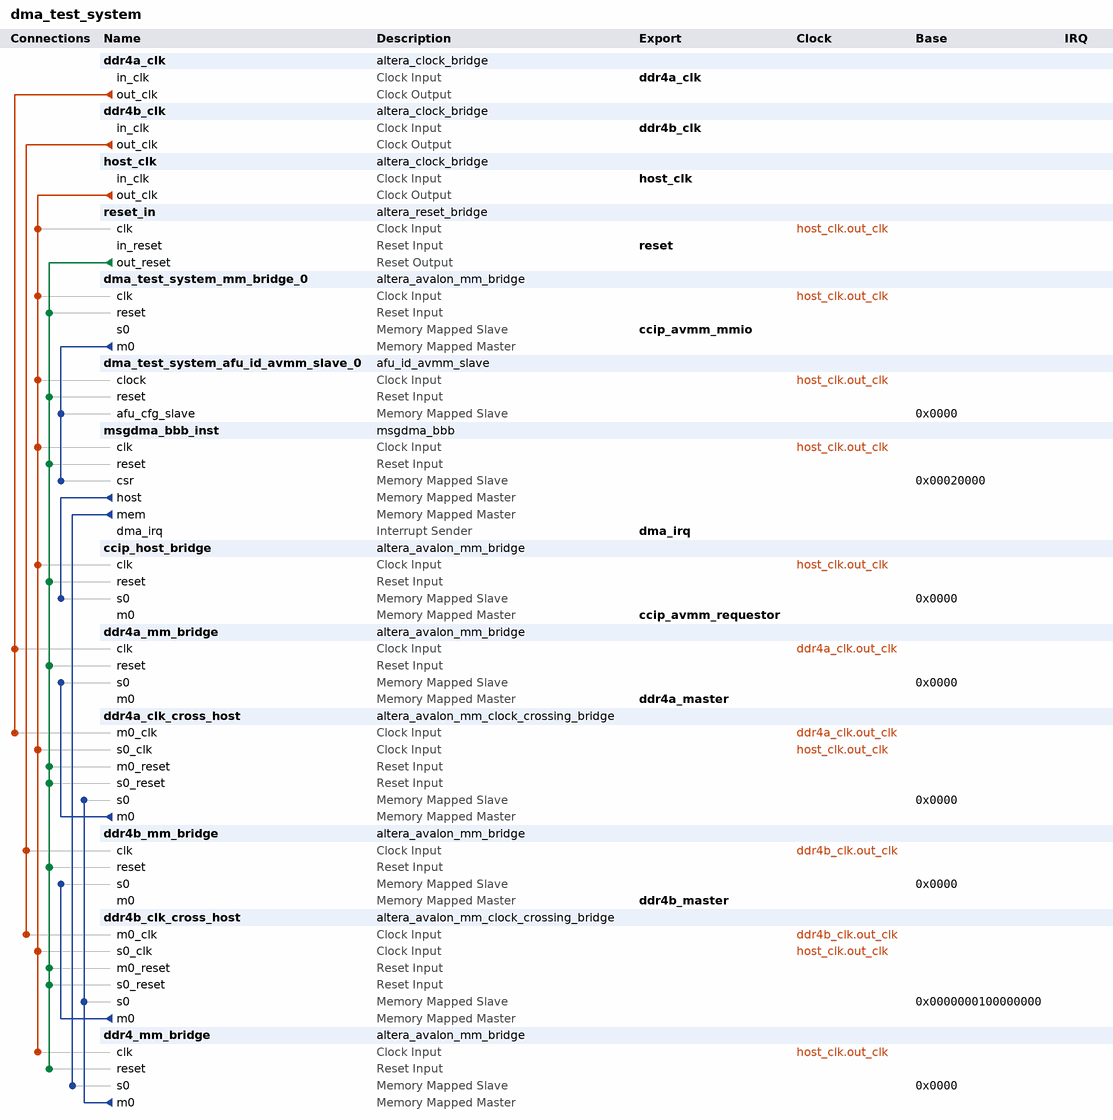
[diagram p0: system contents]
# Platform Designer (Qsys) system dma_test_system, Arria 10 10AX115N3F40E2SG
# Parameters at their usual value, and those the tool derives, are not listed.
package require -exact qsys 1.0
create_system dma_test_system
set_project_property DEVICE_FAMILY {Arria 10}
set_project_property DEVICE 10AX115N3F40E2SG

add_component ddr4a_clk ip/dma_test_system/dma_test_system_clock_bridge_1.ip altera_clock_bridge ddr4a_clk 17.0

add_component ddr4b_clk ip/dma_test_system/dma_test_system_clock_bridge_0.ip altera_clock_bridge ddr4b_clk 17.0
load_component ddr4b_clk
set_component_parameter_value DERIVED_CLOCK_RATE 0
set_component_parameter_value EXPLICIT_CLOCK_RATE 400
save_component

add_component host_clk ip/dma_test_system/dma_test_system_clock_bridge_2.ip altera_clock_bridge host_clk 17.0

add_component reset_in ip/dma_test_system/dma_test_system_reset_in.ip altera_reset_bridge reset_in 17.0
load_component reset_in
set_component_parameter_value ACTIVE_LOW_RESET 0
set_component_parameter_value SYNCHRONOUS_EDGES both
save_component

add_component dma_test_system_mm_bridge_0 ip/dma_test_system/dma_test_system_mm_bridge_0.ip altera_avalon_mm_bridge dma_test_system_mm_bridge_0 17.0

add_component dma_test_system_afu_id_avmm_slave_0 ip/dma_test_system/dma_test_system_afu_id_avmm_slave_0.ip afu_id_avmm_slave dma_test_system_afu_id_avmm_slave_0 1.0
load_component dma_test_system_afu_id_avmm_slave_0
set_component_parameter_value AFU_ID_H 3683296936938783210
set_component_parameter_value AFU_ID_L 10412877091747224746
set_component_parameter_value CREATE_SCRATCH_REG 0
save_component

add_instance msgdma_bbb_inst msgdma_bbb 1.0

add_component ccip_host_bridge ip/dma_test_system/dma_test_system_mm_bridge_2.ip altera_avalon_mm_bridge ccip_host_bridge 17.0
load_component ccip_host_bridge
set_component_parameter_value DATA_WIDTH 512
set_component_parameter_value ADDRESS_WIDTH 48
set_component_parameter_value USE_AUTO_ADDRESS_WIDTH 0
set_component_parameter_value ADDRESS_UNITS SYMBOLS
set_component_parameter_value MAX_BURST_SIZE 4
set_component_parameter_value MAX_PENDING_RESPONSES 64
save_component

add_component ddr4a_mm_bridge ip/dma_test_system/ddr4a_mm_bridge.ip altera_avalon_mm_bridge ddr4a_mm_bridge 17.0
load_component ddr4a_mm_bridge
set_component_parameter_value DATA_WIDTH 512
set_component_parameter_value ADDRESS_WIDTH 32
set_component_parameter_value USE_AUTO_ADDRESS_WIDTH 0
set_component_parameter_value ADDRESS_UNITS SYMBOLS
set_component_parameter_value MAX_BURST_SIZE 4
set_component_parameter_value MAX_PENDING_RESPONSES 64
save_component

add_component ddr4a_clk_cross_host ip/dma_test_system/dma_test_system_mm_clock_crossing_bridge_1.ip altera_avalon_mm_clock_crossing_bridge ddr4a_clk_cross_host 17.0

add_component ddr4b_mm_bridge ip/dma_test_system/ddr4a_mm_bridge_0.ip altera_avalon_mm_bridge ddr4b_mm_bridge 17.0
load_component ddr4b_mm_bridge
set_component_parameter_value DATA_WIDTH 512
set_component_parameter_value ADDRESS_WIDTH 32
set_component_parameter_value USE_AUTO_ADDRESS_WIDTH 0
set_component_parameter_value ADDRESS_UNITS SYMBOLS
set_component_parameter_value MAX_BURST_SIZE 4
set_component_parameter_value MAX_PENDING_RESPONSES 64
save_component

add_component ddr4b_clk_cross_host ip/dma_test_system/dma_test_system_mm_clock_crossing_bridge_2.ip altera_avalon_mm_clock_crossing_bridge ddr4b_clk_cross_host 17.0

add_component ddr4_mm_bridge ip/dma_test_system/dma_test_system_mm_bridge_1.ip altera_avalon_mm_bridge ddr4_mm_bridge 17.0
load_component ddr4_mm_bridge
set_component_parameter_value DATA_WIDTH 512
set_component_parameter_value ADDRESS_WIDTH 33
set_component_parameter_value USE_AUTO_ADDRESS_WIDTH 0
set_component_parameter_value ADDRESS_UNITS SYMBOLS
set_component_parameter_value MAX_BURST_SIZE 16
set_component_parameter_value MAX_PENDING_RESPONSES 64
save_component

# connections
add_connection ddr4a_clk.out_clk ddr4a_clk_cross_host.m0_clk clock
add_connection ddr4a_clk.out_clk ddr4a_mm_bridge.clk clock
add_connection ddr4b_clk.out_clk ddr4b_clk_cross_host.m0_clk clock
add_connection ddr4b_clk.out_clk ddr4b_mm_bridge.clk clock
add_connection host_clk.out_clk ccip_host_bridge.clk clock
add_connection host_clk.out_clk ddr4_mm_bridge.clk clock
add_connection host_clk.out_clk ddr4a_clk_cross_host.s0_clk clock
add_connection host_clk.out_clk ddr4b_clk_cross_host.s0_clk clock
add_connection host_clk.out_clk dma_test_system_afu_id_avmm_slave_0.clock clock
add_connection host_clk.out_clk dma_test_system_mm_bridge_0.clk clock
add_connection host_clk.out_clk msgdma_bbb_inst.clk clock
add_connection host_clk.out_clk reset_in.clk clock
add_connection reset_in.out_reset ccip_host_bridge.reset reset
add_connection reset_in.out_reset ddr4_mm_bridge.reset reset
add_connection reset_in.out_reset ddr4a_clk_cross_host.m0_reset reset
add_connection reset_in.out_reset ddr4a_clk_cross_host.s0_reset reset
add_connection reset_in.out_reset ddr4a_mm_bridge.reset reset
add_connection reset_in.out_reset ddr4b_clk_cross_host.m0_reset reset
add_connection reset_in.out_reset ddr4b_clk_cross_host.s0_reset reset
add_connection reset_in.out_reset ddr4b_mm_bridge.reset reset
add_connection reset_in.out_reset dma_test_system_afu_id_avmm_slave_0.reset reset
add_connection reset_in.out_reset dma_test_system_mm_bridge_0.reset reset
add_connection reset_in.out_reset msgdma_bbb_inst.reset reset
add_connection ddr4_mm_bridge.m0 ddr4a_clk_cross_host.s0 avalon
set_connection_parameter_value ddr4_mm_bridge.m0/ddr4a_clk_cross_host.s0 baseAddress 0x0000
add_connection ddr4_mm_bridge.m0 ddr4b_clk_cross_host.s0 avalon
set_connection_parameter_value ddr4_mm_bridge.m0/ddr4b_clk_cross_host.s0 baseAddress 0x0000000100000000
add_connection ddr4a_clk_cross_host.m0 ddr4a_mm_bridge.s0 avalon
set_connection_parameter_value ddr4a_clk_cross_host.m0/ddr4a_mm_bridge.s0 baseAddress 0x0000
add_connection ddr4b_clk_cross_host.m0 ddr4b_mm_bridge.s0 avalon
set_connection_parameter_value ddr4b_clk_cross_host.m0/ddr4b_mm_bridge.s0 baseAddress 0x0000
add_connection dma_test_system_mm_bridge_0.m0 dma_test_system_afu_id_avmm_slave_0.afu_cfg_slave avalon
set_connection_parameter_value dma_test_system_mm_bridge_0.m0/dma_test_system_afu_id_avmm_slave_0.afu_cfg_slave baseAddress 0x0000
add_connection dma_test_system_mm_bridge_0.m0 msgdma_bbb_inst.csr avalon
set_connection_parameter_value dma_test_system_mm_bridge_0.m0/msgdma_bbb_inst.csr baseAddress 0x00020000
add_connection msgdma_bbb_inst.host ccip_host_bridge.s0 avalon
set_connection_parameter_value msgdma_bbb_inst.host/ccip_host_bridge.s0 baseAddress 0x0000
add_connection msgdma_bbb_inst.mem ddr4_mm_bridge.s0 avalon
set_connection_parameter_value msgdma_bbb_inst.mem/ddr4_mm_bridge.s0 baseAddress 0x0000

# exported interfaces
add_interface ccip_avmm_mmio avalon slave
set_interface_property ccip_avmm_mmio EXPORT_OF dma_test_system_mm_bridge_0.s0
add_interface ccip_avmm_requestor avalon master
set_interface_property ccip_avmm_requestor EXPORT_OF ccip_host_bridge.m0
add_interface ddr4a_clk clock sink
set_interface_property ddr4a_clk EXPORT_OF ddr4a_clk.in_clk
add_interface ddr4a_master avalon master
set_interface_property ddr4a_master EXPORT_OF ddr4a_mm_bridge.m0
add_interface ddr4b_clk clock sink
set_interface_property ddr4b_clk EXPORT_OF ddr4b_clk.in_clk
add_interface ddr4b_master avalon master
set_interface_property ddr4b_master EXPORT_OF ddr4b_mm_bridge.m0
add_interface dma_irq interrupt sender
set_interface_property dma_irq EXPORT_OF msgdma_bbb_inst.dma_irq
add_interface host_clk clock sink
set_interface_property host_clk EXPORT_OF host_clk.in_clk
add_interface reset reset sink
set_interface_property reset EXPORT_OF reset_in.in_reset

set_interconnect_requirement {$system} qsys_mm.clockCrossingAdapter HANDSHAKE
set_interconnect_requirement {$system} qsys_mm.enableEccProtection FALSE
set_interconnect_requirement {$system} qsys_mm.insertDefaultSlave FALSE
set_interconnect_requirement {$system} qsys_mm.maxAdditionalLatency 1

save_system dma_test_system.qsys
